# EAGLE design Main (EAGLE 7.7.0)
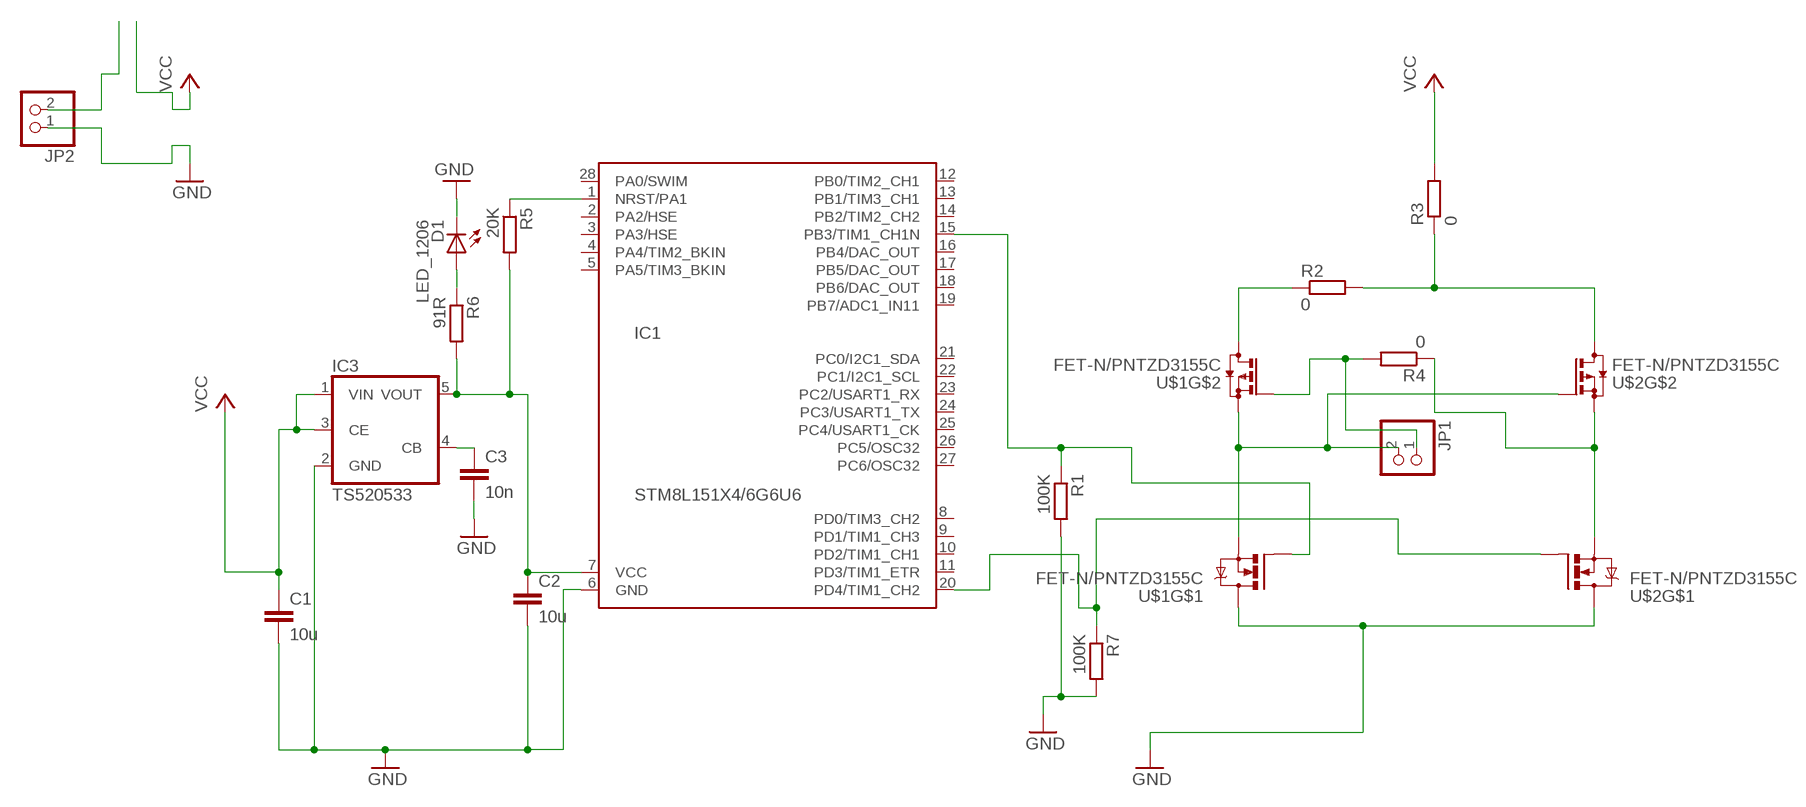
[diagram p0: schematic, sheet 1]

## Parts
C1  10u  C-EUC0805  [C0805]
C2  10u  C-EUC0805  [C0805]
C3  10n  C-EUC0805  [C0805]
D1  LED_1206  [LED1206]
IC1  STM8L151X4/6G6U6  [QFN28]
IC3  TS520533  [SOT25]
JP1  PINHD-1X2  [1X02]
JP2  PINHD-1X2  [1X02]
R1  100K  R_0805  [R0805]
R2  0  R_0805  [R0805]
R3  0  R_0805  [R0805]
R4  0  R_0805  [R0805]
R5  20K  R_0805  [R0805]
R6  91R  R_0805  [R0805]
R7  100K  R_0805  [R0805]
U$1  FET-N/PNTZD3155C  [SOT-563]
U$2  FET-N/PNTZD3155C  [SOT-563]

## Nets
GND: C1.2 C2.2 C3.2 D1.C IC1.6(GND) IC3.2(GND) JP2.1 R1.2 R7.2 U$1.6(D) U$2.6(D)
N$1: D1.A R6.1
N$2: C3.1 IC3.4(CB)
N$3: IC1.1(NRST/PA1) R5.1
N$4: C2.1 IC1.7(VCC) IC3.5(VOUT) R5.2 R6.2
N$5: R4.1 U$2.1(S) U$2.4(S)
N$7: JP1.2 U$1.1(S) U$1.4(S) U$2.5(G)
N$8: IC1.20(PD4/TIM1_CH2) R7.1 U$2.2(G)
N$9: R2.1 U$1.3(D)
N$10: R2.2 R3.1 U$2.3(D)
N$11: JP1.1 R4.2 U$1.5(G)
N$12: IC1.15(PB3/TIM1_CH1N) R1.1 U$1.2(G)
N$13: JP2.2
VCC: C1.1 IC3.1(VIN) IC3.3(CE) R3.2
Unconnected: IC1.2(PA2/HSE) IC1.3(PA3/HSE) IC1.4(PA4/TIM2_BKIN) IC1.5(PA5/TIM3_BKIN) IC1.8(PD0/TIM3_CH2) IC1.9(PD1/TIM1_CH3) IC1.10(PD2/TIM1_CH1) IC1.11(PD3/TIM1_ETR) IC1.12(PB0/TIM2_CH1) IC1.13(PB1/TIM3_CH1) IC1.14(PB2/TIM2_CH2) IC1.16(PB4/DAC_OUT) IC1.17(PB5/DAC_OUT) IC1.18(PB6/DAC_OUT) IC1.19(PB7/ADC1_IN11) IC1.21(PC0/I2C1_SDA) IC1.22(PC1/I2C1_SCL) IC1.23(PC2/USART1_RX) IC1.24(PC3/USART1_TX) IC1.25(PC4/USART1_CK) IC1.26(PC5/OSC32) IC1.27(PC6/OSC32) IC1.28(PA0/SWIM)

## Library data of the parts
C1-C3 = rcl:C-EU: CAPACITOR, European symbol
D1 = Namenlos:LED_
IC1 = Namenlos:STM8L151X4/6
IC3 = v-reg:TS5205: 150mA Low Noise LDO Voltage Regulator with Enable TSC [Taiwan Semiconductor Company, Ltd] Source: http://www.taiwansemi.com .. 5205_0409c.pdf
JP1 JP2 = pinhead:PINHD-1X2: PIN HEADER
R1-R7 = Namenlos:R_
U$1 U$2 = Namenlos:FET-N/P

## Board
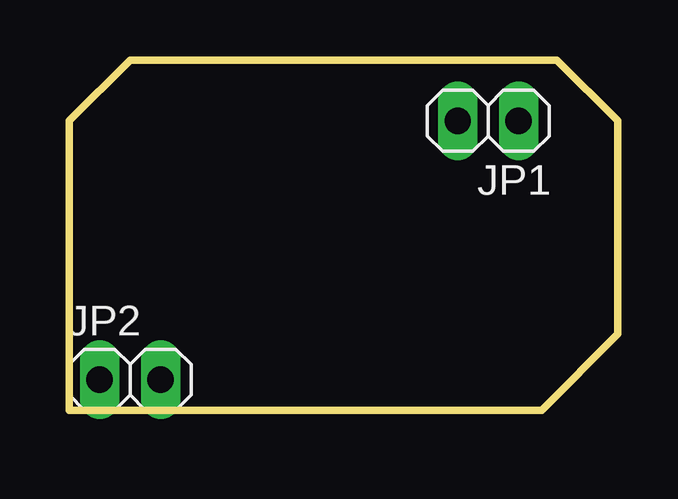
[diagram p1: board, top side]
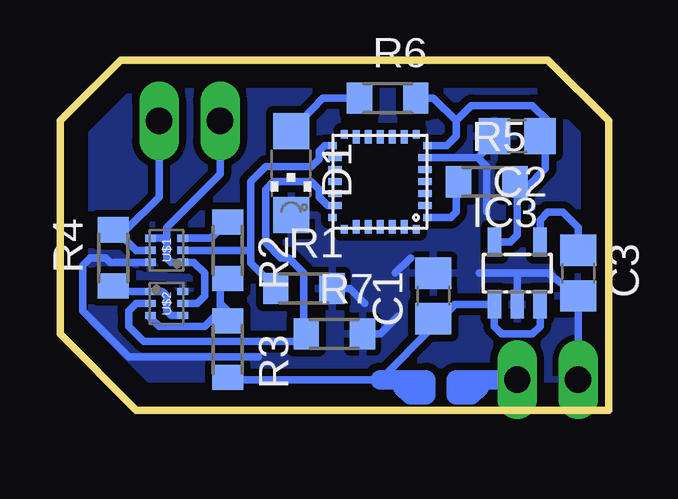
[diagram p2: board, bottom side, seen from below]

Size 22.86 x 14.61 mm. Coordinates in mm from the lower left corner, seen from the top.
Outline: 0,0 0,12.07 2.54,14.61 20.32,14.61 22.86,12.07 22.86,3.17 19.69,0 0,0
Copper layers (1*16): Top 0.035mm / dielectric 1.5mm / Bottom 0.035mm
Design rules "EagleDesignRules": minimum track width 0.2mm, minimum drill 0.3mm, track to track 0.2mm, track to pad 0.2mm, pad to pad 0.2mm, via to via 0.2mm, smd to smd 0.2mm, copper to edge 1mm, drill to drill 0.2mm, minimum pad ring 10mil, minimum via ring 8mil, stop-mask expansion 4mil, vias tented up to drill 0mil, thermal gap 0.25mm

### Footprints (pad centres in the part's own frame; a part is rotated, then mirrored left to right if it is on the bottom)
C0805 = smd 1.3 x 1.5: 1 -0.95,0; 2 0.95,0
LED1206 = smd 1.5 x 1.5: A 0,-1.75; C 0,1.75
QFN28 = smd 0.35 x 0.29: 1 -1.975,1.5; 7 -1.975,-1.5; 15 1.975,-1.5; 21 1.975,1.5 | smd 0.55 x 0.29: 2 -1.875,1; 3 -1.875,0.5; 4 -1.875,0; 5 -1.875,-0.5; 6 -1.875,-1; 16 1.875,-1; 17 1.875,-0.5; 18 1.875,0; 19 1.875,0.5; 20 1.875,1 | smd 0.29 x 0.35: 8 -1.5,-1.975; 14 1.5,-1.975; 22 1.5,1.975; 28 -1.5,1.975 | smd 0.29 x 0.55: 9 -1,-1.875; 10 -0.5,-1.875; 11 0,-1.875; 12 0.5,-1.875; 13 1,-1.875; 23 1,1.875; 24 0.5,1.875; 25 0,1.875; 26 -0.5,1.875; 27 -1,1.875
SOT25 = smd 0.55 x 1.2: 1 -0.95,-1.3; 2 0,-1.3; 3 0.95,-1.3; 4 0.95,1.3; 5 -0.95,1.3
1X02 = drill 1.1 long: 1 -1.27,0; 2 1.27,0
R0805 = smd 1.05 x 1.3: 1 -1.175,0; 2 1.175,0
SOT-563 = smd 0.3 x 0.45: 1 -0.5,-0.674; 2 0,-0.674; 3 0.5,-0.674; 4 0.5,0.674; 5 0,0.674; 6 -0.5,0.674

### Placement (x,y rotation side)
C1  7.3,4.76 90 bottom
C2  3.81,11.43 180 bottom
C3  1.27,5.72 270 bottom
D1  13.23,9.88 180 bottom
IC1  9.53,9.52 180 bottom
IC3  3.81,5.72 0 bottom
JP1  17.46,12.07 180 top
JP2  2.54,1.27 0 top
R1  12.7,5.08 0 bottom
R2  15.88,6.67 270 bottom
R3  15.88,2.54 270 bottom
R4  20.64,6.35 90 bottom
R5  5.08,9.52 0 bottom
R6  9.21,13.02 0 bottom
R7  11.43,3.17 0 bottom
U$1  18.41,6.67 90 bottom
U$2  18.41,4.45 270 bottom

### Tracks (layer width: path | path; a pad name or v marks a point on that pad's centre or on a via)
GND
  Bottom 0.305: IC1.6 5.45,10.52 | 5.45,10.52 5.08,10.16 5.08,8.25 | 8.26,6.35 8.89,5.72 | IC3.2 3.81,5.72 | 3.81,5.72 2.54,5.72 C3.2 JP2.1 | C2.2 4.99,10.98 5.45,10.52 | 8.79,3.91 9.53,3.17 R7.2 | R1.2 10.79,5.08 10.16,4.45 | 14.6,2.22 20,2.22 21.91,4.13 21.91,6.03 21.59,6.35 20.95,6.35 20.77,6.17 U$1.6 | 5.4,5.72 3.81,5.72
  pour Bottom (isolate 0.305): 0,0 0,12.07 2.54,14.61 20.32,14.61 22.86,12.07 22.86,3.17 19.69,0
N$1
  Bottom 0.305: R6.1 11.91,13.02 D1.A
N$2
  Bottom 0.305: IC3.4 2.86,7.93 2.54,8.25 1.91,8.25 1.27,7.62 C3.1
N$3
  Bottom 0.305: IC1.1 6.58,8.02 6.35,8.25 6.35,9.43 R5.1
N$4
  Bottom 0.305: IC1.7 6.76,11.02 6.35,11.43 6.35,12.07 | 6.35,12.07 5.71,12.7 3.18,12.7 2.54,12.07 2.54,11.52 C2.1 2.63,11.21 2.63,10.07 3.49,9.21 3.59,9.21 3.81,9.43 | IC3.5 4.1,7.01 3.81,7.3 3.81,9.43 | R5.2 3.81,9.43 | R6.2 7.3,13.02 6.35,12.07
N$5
  Bottom 0.305: U$2.4 18.23,3.95 18.41,4.13 18.41,4.76 18.6,4.94 U$2.1 20.09,4.94 R4.1
N$6
  cutout Bottom (isolate 0.61, rank 2): 7.62,7.62 7.62,11.43 11.43,11.43 11.43,7.62
N$7
  Bottom 0.305: U$2.5 17.15,4.45 16.83,4.76 16.83,5.72 17.28,6.17 U$1.1 18.23,6.17 18.41,6.35 18.41,6.99 | U$1.4 18.6,7.17 18.41,6.99 | JP1.2 16.19,9.84 18.41,7.62 18.41,6.99
N$8
  Bottom 0.305: U$2.2 19.69,4.45 20,4.13 20,3.49 19.37,2.86 12.92,2.86 R7.1 12.7,3.27 12.7,5.72 13.33,6.35 13.65,6.35 14.29,6.99 14.29,9.21 13.97,9.52 12.38,9.52 12.06,9.21 12.06,8.89 11.7,8.52 IC1.20
N$9
  Bottom 0.305: U$1.3 16.55,7.17 R2.1
N$10
  Bottom 0.305: U$2.3 19.09,3.85 18.73,3.49 16.83,3.49 16.19,4.13 16.19,4.45 | 16.19,4.45 16.19,5.4 16.1,5.49 R2.2 | R3.1 15.88,4.13 16.19,4.45
N$11
  Bottom 0.305: U$1.5 19.69,6.67 20.54,7.52 | R4.2 20.54,7.52 | 20.54,7.52 20.1,7.52 18.73,8.89 JP1.1
N$12
  Bottom 0.305: U$1.2 14.92,6.67 | 13.97,5.17 R1.1 14.92,6.13 14.92,6.67 | IC1.15 11.83,11.02 12.06,10.8 12.06,10.48 12.38,10.16 14.29,10.16 14.92,9.52 14.92,6.67
N$13
  Bottom 0.813: JP2.2 6.35,1.27 6.35,0.64 5.71,0.64 5.4,0.95
VCC
  Bottom 0.305: IC3.3 2.86,3.49 3.18,3.17 4.45,3.17 4.76,3.49 IC3.1 6.42,4.42 6.42,4.38 7.3,3.49 | 7.3,3.49 9.53,1.27 15.78,1.27 R3.2 | C1.1 7.3,3.49
  Bottom 0.813: 9.53,1.27 8.57,1.27 | 8.57,1.27 7.62,1.27 7.62,0.64 8.26,0.64 8.57,0.95 8.57,1.27